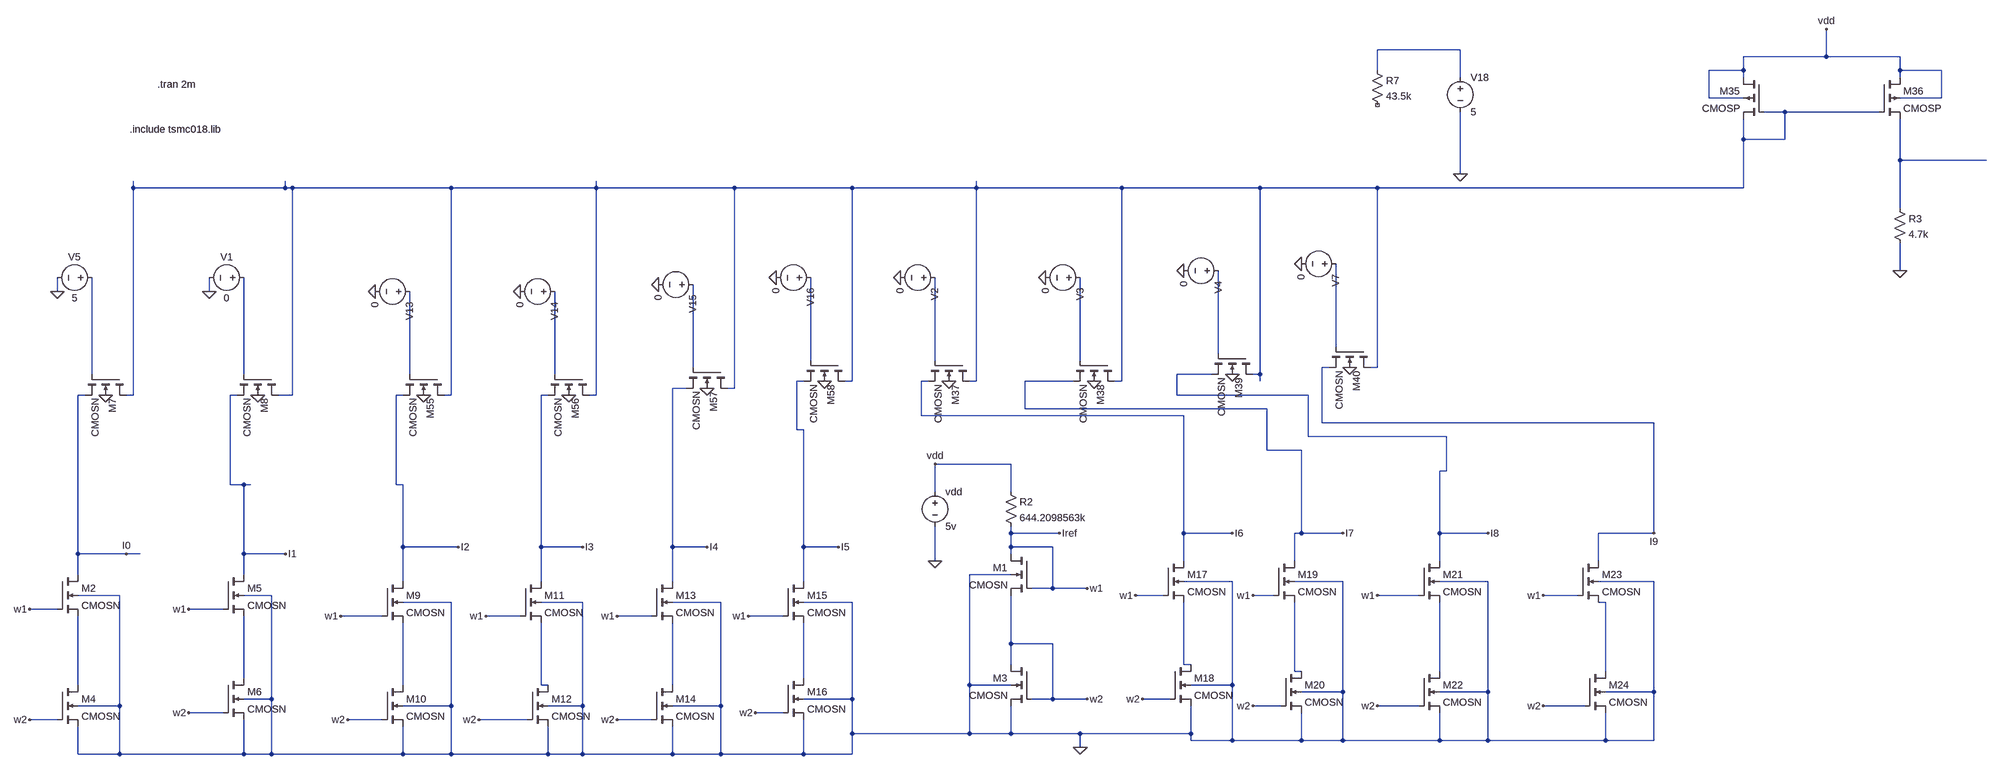
[diagram p0: schematic current_steering_dac_using_current_mirror.asc]
current_steering_dac_using_current_mirror.asc, the LTspice schematic file:
Version 4
SHEET 1 7472 1236
WIRE 3696 -1168 3504 -1168
WIRE 4560 -1152 4560 -1216
WIRE 4560 -1152 4368 -1152
WIRE 4752 -1152 4560 -1152
WIRE 3504 -1120 3504 -1168
WIRE 4368 -1120 4368 -1152
WIRE 4368 -1120 4288 -1120
WIRE 4752 -1120 4752 -1152
WIRE 4848 -1120 4752 -1120
WIRE 3696 -1104 3696 -1168
WIRE 4368 -1104 4368 -1120
WIRE 4752 -1104 4752 -1120
WIRE 4288 -1056 4288 -1120
WIRE 4368 -1056 4288 -1056
WIRE 4848 -1056 4848 -1120
WIRE 4848 -1056 4752 -1056
WIRE 4464 -1024 4416 -1024
WIRE 4704 -1024 4464 -1024
WIRE 4368 -960 4368 -1008
WIRE 4464 -960 4464 -1024
WIRE 4464 -960 4368 -960
WIRE 4752 -912 4752 -1008
WIRE 5104 -912 4752 -912
WIRE 3696 -880 3696 -1024
WIRE 624 -848 624 -864
WIRE 976 -848 976 -864
WIRE 976 -848 624 -848
WIRE 992 -848 976 -848
WIRE 1360 -848 992 -848
WIRE 1696 -848 1696 -864
WIRE 1696 -848 1360 -848
WIRE 2016 -848 1696 -848
WIRE 2288 -848 2016 -848
WIRE 2576 -848 2576 -864
WIRE 2576 -848 2288 -848
WIRE 2912 -848 2576 -848
WIRE 3232 -848 2912 -848
WIRE 3504 -848 3232 -848
WIRE 4368 -848 4368 -960
WIRE 4368 -848 3504 -848
WIRE 4752 -800 4752 -912
WIRE 4752 -656 4752 -720
WIRE 448 -608 448 -640
WIRE 800 -608 800 -640
WIRE 3408 -480 3408 -672
WIRE 3136 -464 3136 -656
WIRE 2192 -448 2192 -640
WIRE 2480 -448 2480 -640
WIRE 2816 -448 2816 -640
WIRE 1920 -432 1920 -624
WIRE 3392 -432 3376 -432
WIRE 3504 -432 3504 -848
WIRE 3504 -432 3488 -432
WIRE 528 -416 528 -640
WIRE 880 -416 880 -640
WIRE 1264 -416 1264 -608
WIRE 1600 -416 1600 -608
WIRE 3120 -416 3040 -416
WIRE 3232 -416 3232 -848
WIRE 3232 -416 3216 -416
WIRE 2176 -400 2160 -400
WIRE 2288 -400 2288 -848
WIRE 2288 -400 2272 -400
WIRE 2464 -400 2448 -400
WIRE 2576 -400 2576 -848
WIRE 2576 -400 2560 -400
WIRE 2800 -400 2688 -400
WIRE 2912 -400 2912 -848
WIRE 2912 -400 2896 -400
WIRE 3232 -400 3232 -416
WIRE 1904 -384 1872 -384
WIRE 2016 -384 2016 -848
WIRE 2016 -384 2000 -384
WIRE 512 -368 496 -368
WIRE 624 -368 624 -848
WIRE 624 -368 608 -368
WIRE 864 -368 848 -368
WIRE 992 -368 992 -848
WIRE 992 -368 960 -368
WIRE 1248 -368 1232 -368
WIRE 1360 -368 1360 -848
WIRE 1360 -368 1344 -368
WIRE 1584 -368 1568 -368
WIRE 1696 -368 1696 -848
WIRE 1696 -368 1680 -368
WIRE 3040 -368 3040 -416
WIRE 3344 -368 3040 -368
WIRE 2688 -336 2688 -400
WIRE 3248 -336 2688 -336
WIRE 2448 -320 2448 -400
WIRE 3056 -320 2448 -320
WIRE 3376 -304 3376 -432
WIRE 4144 -304 3376 -304
WIRE 2160 -288 2160 -400
WIRE 2176 -288 2160 -288
WIRE 3344 -272 3344 -368
WIRE 3664 -272 3344 -272
WIRE 3248 -240 3248 -336
WIRE 3328 -240 3248 -240
WIRE 2656 -208 2480 -208
WIRE 3664 -192 3664 -272
WIRE 3664 -192 3648 -192
WIRE 848 -160 848 -368
WIRE 880 -160 848 -160
WIRE 896 -160 880 -160
WIRE 1232 -160 1232 -368
WIRE 1248 -160 1232 -160
WIRE 2480 -144 2480 -208
WIRE 2656 -144 2656 -208
WIRE 2656 -48 2656 -64
WIRE 2768 -48 2656 -48
WIRE 3056 -48 3056 -320
WIRE 3168 -48 3056 -48
WIRE 3328 -48 3328 -240
WIRE 3328 -48 3312 -48
WIRE 3424 -48 3328 -48
WIRE 3648 -48 3648 -192
WIRE 3760 -48 3648 -48
WIRE 4144 -48 4144 -304
WIRE 4144 -48 4016 -48
WIRE 1248 -16 1248 -160
WIRE 1376 -16 1248 -16
WIRE 1568 -16 1568 -368
WIRE 1664 -16 1568 -16
WIRE 1872 -16 1872 -384
WIRE 1952 -16 1872 -16
WIRE 2176 -16 2176 -288
WIRE 2256 -16 2176 -16
WIRE 2656 -16 2656 -48
WIRE 2752 -16 2656 -16
WIRE 496 0 496 -368
WIRE 608 0 496 0
WIRE 640 0 608 0
WIRE 880 0 880 -160
WIRE 976 0 880 0
WIRE 2656 0 2656 -16
WIRE 2480 16 2480 -64
WIRE 3056 16 3056 -48
WIRE 3312 16 3312 -48
WIRE 3648 16 3648 -48
WIRE 4016 16 4016 -48
WIRE 496 48 496 0
WIRE 880 48 880 0
WIRE 2656 48 2560 48
WIRE 1248 64 1248 -16
WIRE 1568 64 1568 -16
WIRE 1872 64 1872 -16
WIRE 2176 64 2176 -16
WIRE 3168 64 3056 64
WIRE 3424 64 3312 64
WIRE 3760 64 3648 64
WIRE 4144 64 4016 64
WIRE 2752 80 2752 -16
WIRE 2752 80 2704 80
WIRE 2832 80 2752 80
WIRE 592 96 496 96
WIRE 944 96 880 96
WIRE 3008 96 2944 96
WIRE 3264 96 3216 96
WIRE 3600 96 3504 96
WIRE 3968 96 3888 96
WIRE 1360 112 1248 112
WIRE 1664 112 1568 112
WIRE 1984 112 1872 112
WIRE 2288 112 2176 112
WIRE 4032 112 4016 112
WIRE 448 128 384 128
WIRE 832 128 752 128
WIRE 1200 144 1104 144
WIRE 1520 144 1440 144
WIRE 1824 144 1744 144
WIRE 2128 144 2048 144
WIRE 2656 208 2656 96
WIRE 2752 208 2656 208
WIRE 2656 256 2656 208
WIRE 3056 256 3056 112
WIRE 3072 256 3056 256
WIRE 3312 272 3312 112
WIRE 3328 272 3312 272
WIRE 3648 272 3648 112
WIRE 4032 272 4032 112
WIRE 880 288 880 144
WIRE 2176 288 2176 160
WIRE 496 304 496 144
WIRE 1248 304 1248 160
WIRE 1568 304 1568 160
WIRE 1584 304 1568 304
WIRE 1872 304 1872 160
WIRE 2560 304 2560 48
WIRE 2656 304 2560 304
WIRE 3168 304 3168 64
WIRE 3168 304 3072 304
WIRE 3424 320 3424 64
WIRE 3424 320 3328 320
WIRE 3760 320 3760 64
WIRE 3760 320 3648 320
WIRE 4144 320 4144 64
WIRE 4144 320 4032 320
WIRE 944 336 944 96
WIRE 944 336 880 336
WIRE 2288 336 2288 112
WIRE 2288 336 2176 336
WIRE 2752 336 2752 208
WIRE 2752 336 2704 336
WIRE 2832 336 2752 336
WIRE 3024 336 2960 336
WIRE 592 352 592 96
WIRE 592 352 496 352
WIRE 1360 352 1360 112
WIRE 1360 352 1248 352
WIRE 1664 352 1664 112
WIRE 1664 352 1584 352
WIRE 1984 352 1984 112
WIRE 1984 352 1872 352
WIRE 3280 352 3216 352
WIRE 3600 352 3504 352
WIRE 3984 352 3888 352
WIRE 832 368 752 368
WIRE 2128 368 2064 368
WIRE 448 384 384 384
WIRE 1200 384 1120 384
WIRE 1536 384 1424 384
WIRE 1824 384 1744 384
WIRE 2288 416 2288 336
WIRE 2560 416 2560 304
WIRE 2560 416 2288 416
WIRE 2656 416 2656 352
WIRE 2656 416 2560 416
WIRE 2816 416 2656 416
WIRE 3072 416 3072 352
WIRE 3072 416 2816 416
WIRE 3072 432 3072 416
WIRE 3168 432 3168 304
WIRE 3168 432 3072 432
WIRE 3328 432 3328 368
WIRE 3328 432 3168 432
WIRE 3424 432 3424 320
WIRE 3424 432 3328 432
WIRE 3648 432 3648 368
WIRE 3648 432 3424 432
WIRE 3760 432 3760 320
WIRE 3760 432 3648 432
WIRE 4032 432 4032 368
WIRE 4032 432 3760 432
WIRE 4144 432 4144 320
WIRE 4144 432 4032 432
WIRE 2816 448 2816 416
WIRE 496 464 496 400
WIRE 592 464 592 352
WIRE 592 464 496 464
WIRE 880 464 880 384
WIRE 880 464 592 464
WIRE 944 464 944 336
WIRE 944 464 880 464
WIRE 1248 464 1248 400
WIRE 1248 464 944 464
WIRE 1360 464 1360 352
WIRE 1360 464 1248 464
WIRE 1584 464 1584 400
WIRE 1584 464 1360 464
WIRE 1664 464 1664 352
WIRE 1664 464 1584 464
WIRE 1872 464 1872 400
WIRE 1872 464 1664 464
WIRE 1984 464 1984 352
WIRE 1984 464 1872 464
WIRE 2176 464 2176 384
WIRE 2176 464 1984 464
WIRE 2288 464 2288 416
WIRE 2288 464 2176 464
FLAG 2816 448 0
FLAG 2480 16 0
FLAG 2768 -48 Iref
FLAG 608 0 I0
FLAG 2832 80 w1
FLAG 2832 336 w2
FLAG 752 368 w2
FLAG 752 128 w1
FLAG 976 0 I1
FLAG 1104 144 w1
FLAG 1440 144 w1
FLAG 1744 144 w1
FLAG 2048 144 w1
FLAG 2944 96 w1
FLAG 3216 96 w1
FLAG 3504 96 w1
FLAG 3888 96 w1
FLAG 1120 384 w2
FLAG 1424 384 w2
FLAG 2064 368 w2
FLAG 2960 336 w2
FLAG 3216 352 w2
FLAG 3504 352 w2
FLAG 3888 352 w2
FLAG 1744 384 w2
FLAG 1376 -16 I2
FLAG 1664 -16 I3
FLAG 1952 -16 I4
FLAG 2256 -16 I5
FLAG 3168 -48 I6
FLAG 3424 -48 I7
FLAG 3760 -48 I8
FLAG 4144 -48 I9
FLAG 800 -608 0
FLAG 448 -608 0
FLAG 1184 -608 0
FLAG 1296 -368 0
FLAG 1520 -608 0
FLAG 1632 -368 0
FLAG 1840 -624 0
FLAG 1952 -384 0
FLAG 2112 -640 0
FLAG 2224 -400 0
FLAG 2400 -640 0
FLAG 2512 -400 0
FLAG 2736 -640 0
FLAG 2848 -400 0
FLAG 3056 -656 0
FLAG 3168 -416 0
FLAG 3328 -672 0
FLAG 3440 -432 0
FLAG 384 128 w1
FLAG 384 384 w2
FLAG 3696 -880 0
FLAG 2480 -208 vdd
FLAG 4560 -1216 vdd
FLAG 4752 -656 0
FLAG 560 -368 0
FLAG 912 -368 0
DATAFLAG 2656 -16 ""
DATAFLAG 2656 128 ""
DATAFLAG 2656 384 ""
DATAFLAG 4656 -1024 ""
DATAFLAG 4912 -912 ""
DATAFLAG 4752 -688 ""
SYMBOL cmosn 2704 0 M0
SYMATTR InstName M1
SYMATTR Value2 l=5u w=640u
SYMBOL cmosn 448 48 R0
SYMATTR InstName M2
SYMATTR Value2 l=5u w=10u
SYMBOL cmosn 2704 256 M0
SYMATTR InstName M3
SYMATTR Value2 l=5u w=640u
SYMBOL cmosn 448 304 R0
SYMATTR InstName M4
SYMATTR Value2 l=5u w=10u
SYMBOL voltage 2480 -160 R0
WINDOW 123 0 0 Left 0
WINDOW 39 0 0 Left 0
SYMATTR InstName vdd
SYMATTR Value 5v
SYMBOL cmosn 832 48 R0
SYMATTR InstName M5
SYMATTR Value2 l=5u w=20u
SYMBOL cmosn 832 288 R0
SYMATTR InstName M6
SYMATTR Value2 l=5u w=20u
SYMBOL cmosn 1200 64 R0
SYMATTR InstName M9
SYMATTR Value2 l=5u w=40u
SYMBOL cmosn 1200 304 R0
SYMATTR InstName M10
SYMATTR Value2 l=5u w=40u
SYMBOL cmosn 1520 64 R0
SYMATTR InstName M11
SYMATTR Value2 l=5u w=80u
SYMBOL cmosn 1536 304 R0
SYMATTR InstName M12
SYMATTR Value2 l=5u w=80u
SYMBOL cmosn 1824 64 R0
SYMATTR InstName M13
SYMATTR Value2 l=5u w=160u
SYMBOL cmosn 1824 304 R0
SYMATTR InstName M14
SYMATTR Value2 l=5u w=160u
SYMBOL cmosn 2128 64 R0
SYMATTR InstName M15
SYMATTR Value2 l=5u w=320u
SYMBOL cmosn 2128 288 R0
SYMATTR InstName M16
SYMATTR Value2 l=5u w=320u
SYMBOL cmosn 3008 16 R0
SYMATTR InstName M17
SYMATTR Value2 l=5u w=640u
SYMBOL cmosn 3024 256 R0
SYMATTR InstName M18
SYMATTR Value2 l=5u w=640u
SYMBOL cmosn 3264 16 R0
SYMATTR InstName M19
SYMATTR Value2 l=5u w=1280u
SYMBOL cmosn 3280 272 R0
SYMATTR InstName M20
SYMATTR Value2 l=5u w=1280u
SYMBOL cmosn 3600 16 R0
SYMATTR InstName M21
SYMATTR Value2 l=5u w=2560u
SYMBOL cmosn 3600 272 R0
SYMATTR InstName M22
SYMATTR Value2 l=5u w=2560u
SYMBOL cmosn 3968 16 R0
SYMATTR InstName M23
SYMATTR Value2 l=5u w=5120u
SYMBOL cmosn 3984 272 R0
SYMATTR InstName M24
SYMATTR Value2 l=5u w=5120u
SYMBOL cmosn 1344 -416 R90
SYMATTR InstName M55
SYMATTR Value2 l=5u w=10u
SYMBOL voltage 1280 -608 R90
WINDOW 123 0 0 Left 0
WINDOW 39 0 0 Left 0
SYMATTR InstName V13
SYMATTR Value 0
SYMBOL cmosn 1680 -416 R90
SYMATTR InstName M56
SYMATTR Value2 l=5u w=10u
SYMBOL voltage 1616 -608 R90
WINDOW 123 0 0 Left 0
WINDOW 39 0 0 Left 0
SYMATTR InstName V14
SYMATTR Value 0
SYMBOL cmosn 2000 -432 R90
SYMATTR InstName M57
SYMATTR Value2 l=5u w=10u
SYMBOL voltage 1936 -624 R90
WINDOW 123 0 0 Left 0
WINDOW 39 0 0 Left 0
SYMATTR InstName V15
SYMATTR Value 0
SYMBOL cmosn 2272 -448 R90
SYMATTR InstName M58
SYMATTR Value2 l=5u w=10u
SYMBOL voltage 2208 -640 R90
WINDOW 123 0 0 Left 0
WINDOW 39 0 0 Left 0
SYMATTR InstName V16
SYMATTR Value 0
SYMBOL cmosn 2560 -448 R90
SYMATTR InstName M37
SYMATTR Value2 l=5u w=10u
SYMBOL voltage 2496 -640 R90
WINDOW 123 0 0 Left 0
WINDOW 39 0 0 Left 0
SYMATTR InstName V2
SYMATTR Value 0
SYMBOL cmosn 2896 -448 R90
SYMATTR InstName M38
SYMATTR Value2 l=5u w=10u
SYMBOL voltage 2832 -640 R90
WINDOW 123 0 0 Left 0
WINDOW 39 0 0 Left 0
SYMATTR InstName V3
SYMATTR Value 0
SYMBOL cmosn 3216 -464 R90
SYMATTR InstName M39
SYMATTR Value2 l=5u w=10u
SYMBOL voltage 3152 -656 R90
WINDOW 123 0 0 Left 0
WINDOW 39 0 0 Left 0
SYMATTR InstName V4
SYMATTR Value 0
SYMBOL cmosn 3488 -480 R90
SYMATTR InstName M40
SYMATTR Value2 l=5u w=10u
SYMBOL voltage 3424 -672 R90
WINDOW 123 0 0 Left 0
WINDOW 39 0 0 Left 0
SYMATTR InstName V7
SYMATTR Value 0
SYMBOL res 2640 -160 R0
SYMATTR InstName R2
SYMATTR Value 644.2098563k
SYMBOL voltage 3696 -1120 R0
WINDOW 123 0 0 Left 0
WINDOW 39 0 0 Left 0
SYMATTR InstName V18
SYMATTR Value 5
SYMBOL res 3488 -1136 R0
SYMATTR InstName R7
SYMATTR Value 43.5k
SYMBOL cmosn 608 -416 R90
SYMATTR InstName M7
SYMATTR Value2 l=5u w=10u
SYMBOL cmosn 960 -416 R90
SYMATTR InstName M8
SYMATTR Value2 l=5u w=10u
SYMBOL voltage 896 -640 R90
WINDOW 0 -32 56 VBottom 2
WINDOW 3 32 56 VTop 2
WINDOW 123 0 0 Left 0
WINDOW 39 0 0 Left 0
SYMATTR InstName V1
SYMATTR Value 0
SYMBOL voltage 544 -640 R90
WINDOW 0 -32 56 VBottom 2
WINDOW 3 32 56 VTop 2
WINDOW 123 0 0 Left 0
WINDOW 39 0 0 Left 0
SYMATTR InstName V5
SYMATTR Value 5
SYMBOL cmosp 4416 -1104 M0
SYMATTR InstName M35
SYMATTR Value2 l=5u w=100u
SYMBOL cmosp 4704 -1104 R0
SYMATTR InstName M36
SYMATTR Value2 l=5u w=1000u
SYMBOL res 4736 -816 R0
SYMATTR InstName R3
SYMATTR Value 4.7k
TEXT 616 -984 Left 2 !.include tsmc018.lib
TEXT 680 -1088 Left 2 !.tran 2m

The netlist it stands for:
* current_steering_dac_using_current_mirror.asc
M1 w1 w1 w2 0 CMOSN l=5u w=640u
M2 I0 w1 N020 0 CMOSN l=5u w=10u
M3 w2 w2 0 0 CMOSN l=5u w=640u
M4 N020 w2 0 0 CMOSN l=5u w=10u
vdd vdd 0 5v
M5 I1 w1 N018 0 CMOSN l=5u w=20u
M6 N018 w2 0 0 CMOSN l=5u w=20u
M9 I2 w1 N021 0 CMOSN l=5u w=40u
M10 N021 w2 0 0 CMOSN l=5u w=40u
M11 I3 w1 N022 0 CMOSN l=5u w=80u
M12 N022 w2 0 0 CMOSN l=5u w=80u
M13 I4 w1 N023 0 CMOSN l=5u w=160u
M14 N023 w2 0 0 CMOSN l=5u w=160u
M15 I5 w1 N019 0 CMOSN l=5u w=320u
M16 N019 w2 0 0 CMOSN l=5u w=320u
M17 I6 w1 N015 0 CMOSN l=5u w=640u
M18 N015 w2 0 0 CMOSN l=5u w=640u
M19 I7 w1 N016 0 CMOSN l=5u w=1280u
M20 N016 w2 0 0 CMOSN l=5u w=1280u
M21 I8 w1 N017 0 CMOSN l=5u w=2560u
M22 N017 w2 0 0 CMOSN l=5u w=2560u
M23 I9 w1 N014 0 CMOSN l=5u w=5120u
M24 N014 w2 0 0 CMOSN l=5u w=5120u
M55 N002 N012 I2 0 CMOSN l=5u w=10u
V13 N012 0 0
M56 N002 N013 I3 0 CMOSN l=5u w=10u
V14 N013 0 0
M57 N002 N009 I4 0 CMOSN l=5u w=10u
V15 N009 0 0
M58 N002 N006 I5 0 CMOSN l=5u w=10u
V16 N006 0 0
M37 N002 N007 I6 0 CMOSN l=5u w=10u
V2 N007 0 0
M38 N002 N008 I7 0 CMOSN l=5u w=10u
V3 N008 0 0
M39 N002 N005 I8 0 CMOSN l=5u w=10u
V4 N005 0 0
M40 N002 N004 I9 0 CMOSN l=5u w=10u
V7 N004 0 0
R2 vdd w1 644.2098563k
V18 N001 0 5
R7 N001 NC_01 43.5k
M7 N002 N010 I0 0 CMOSN l=5u w=10u
M8 N002 N011 I1 0 CMOSN l=5u w=10u
V1 N011 0 0
V5 N010 0 5
M35 vdd N002 N002 vdd CMOSP l=5u w=100u
M36 vdd N002 N003 vdd CMOSP l=5u w=1000u
R3 N003 0 4.7k
.model NMOS NMOS
.model PMOS PMOS
.lib standard.mos
.include tsmc018.lib
.tran 2m
.backanno
.end